# EasyEDA schematic SCH_regulador_carga_2025-11-12.json
TITLE: Sheet_1; REV: 1.0; Date: 2025-09-05; Sheet: 1/1; Drawn By: sahoneromassimo; Company: Your Company
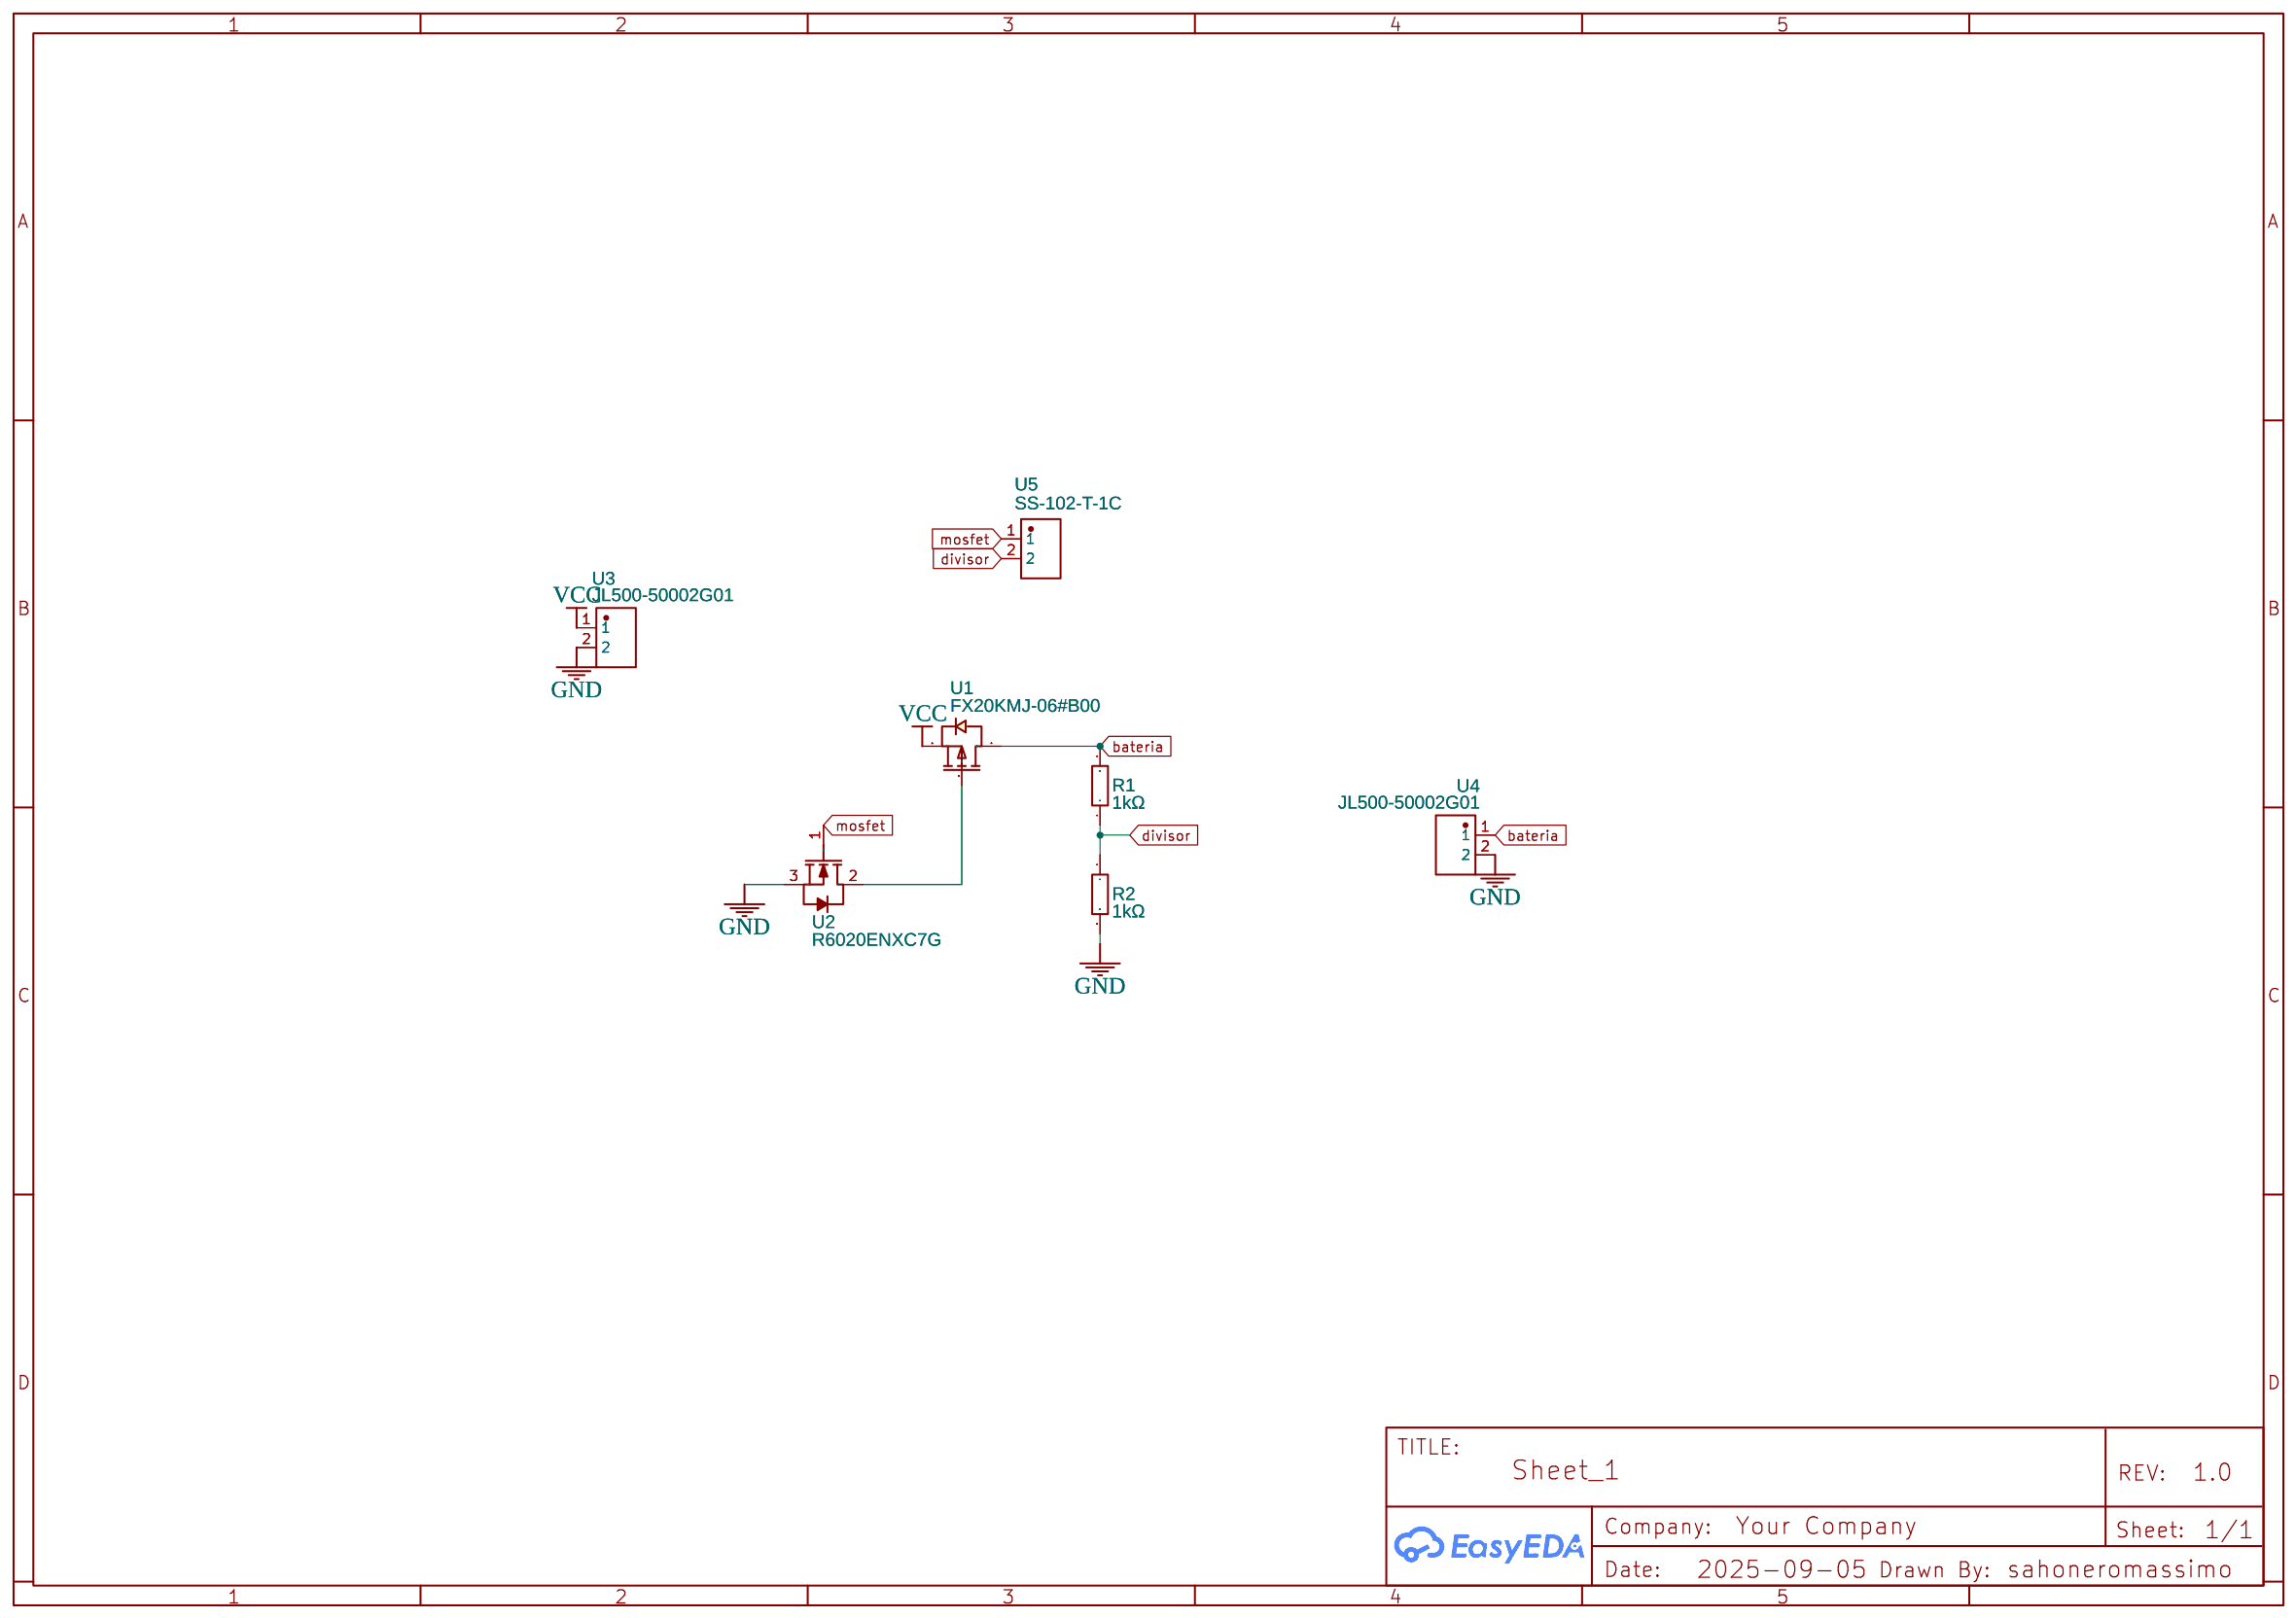
[diagram p0: schematic sheet]

## Parts
R1  1kΩ  [RES-TH_BD2.2-L6.5-P10.50-D0.6]
R2  1kΩ  [RES-TH_BD2.2-L6.5-P10.50-D0.6]
U1  FX20KMJ-06#B00  [TO-220F-3_L10.2-W4.7-P2.54-L]
U2  R6020ENXC7G  [TO-220F-3_L10.2-W4.7-P2.54-L]
U3  JL500-50002G01  [CONN-TH_2P-P5.08_JL500-50002G01]
U4  JL500-50002G01  [CONN-TH_2P-P5.08_JL500-50002G01]
U5  SS-102-T-1C  [HDR-TH_2P-P2.54-V-M-1]

## Library data of the parts
R1 R2 = CFR0W4J0242A50: Contributor: lcsc; Supplier: LCSC; Supplier Part: C2905203; Manufacturer: UNI-ROYAL(厚声); JLCPCB Part Class: Extended Part
U1 = FX20KMJ-06#B00: Contributor: lcsc; Supplier: LCSC; Supplier Part: C3283177; Manufacturer: RENESAS(瑞萨)/IDT
U2 = R6020ENXC7G: Contributor: lcsc; Supplier: LCSC; Supplier Part: C3290594; Manufacturer: ROHM(罗姆)
U3 U4 = JL500-50002G01: Contributor: LCSC; Supplier: LCSC; Supplier Part: C394555; Manufacturer: JILN(锦凌); JLCPCB Part Class: Extended Part
U5 = SS-102-T-1C: Supplier: LCSC; Supplier Part: C7369778; Manufacturer: SAMTEC; JLCPCB Part Class: Extended Part; Contributor: lcsc

## Nets
GND: R2.2 U2.3(S) U3.2 U4.2
VCC: U1.3(S) U3.1
bateria: R1.2 U1.2(D) U4.1
divisor: R1.1 R2.1 U5.2
mosfet: U2.1(G) U5.1
Net-(U1-1): U1.1(G) U2.2(D)
